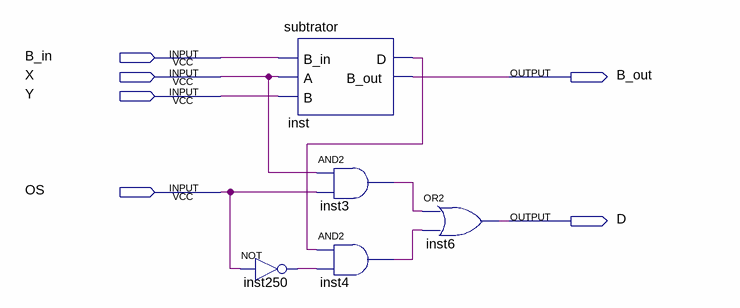
[diagram p0: schematic sheet]
// Quartus schematic csm.bdf as structural Verilog: 5 symbols, 6 pins
module csm (
  input  B_in,
  input  X,
  input  Y,
  input  OS,
  output B_out,
  output D
);

  wire inst3_out, inst4_out, inst250_out, inst_d;

  not inst250 (inst250_out, OS);
  subtrator inst (.B_in(B_in), .A(X), .B(Y), .D(inst_d), .B_out(B_out));
  and inst3 (inst3_out, X, OS);
  and inst4 (inst4_out, inst_d, inst250_out);
  or inst6 (D, inst3_out, inst4_out);
endmodule
